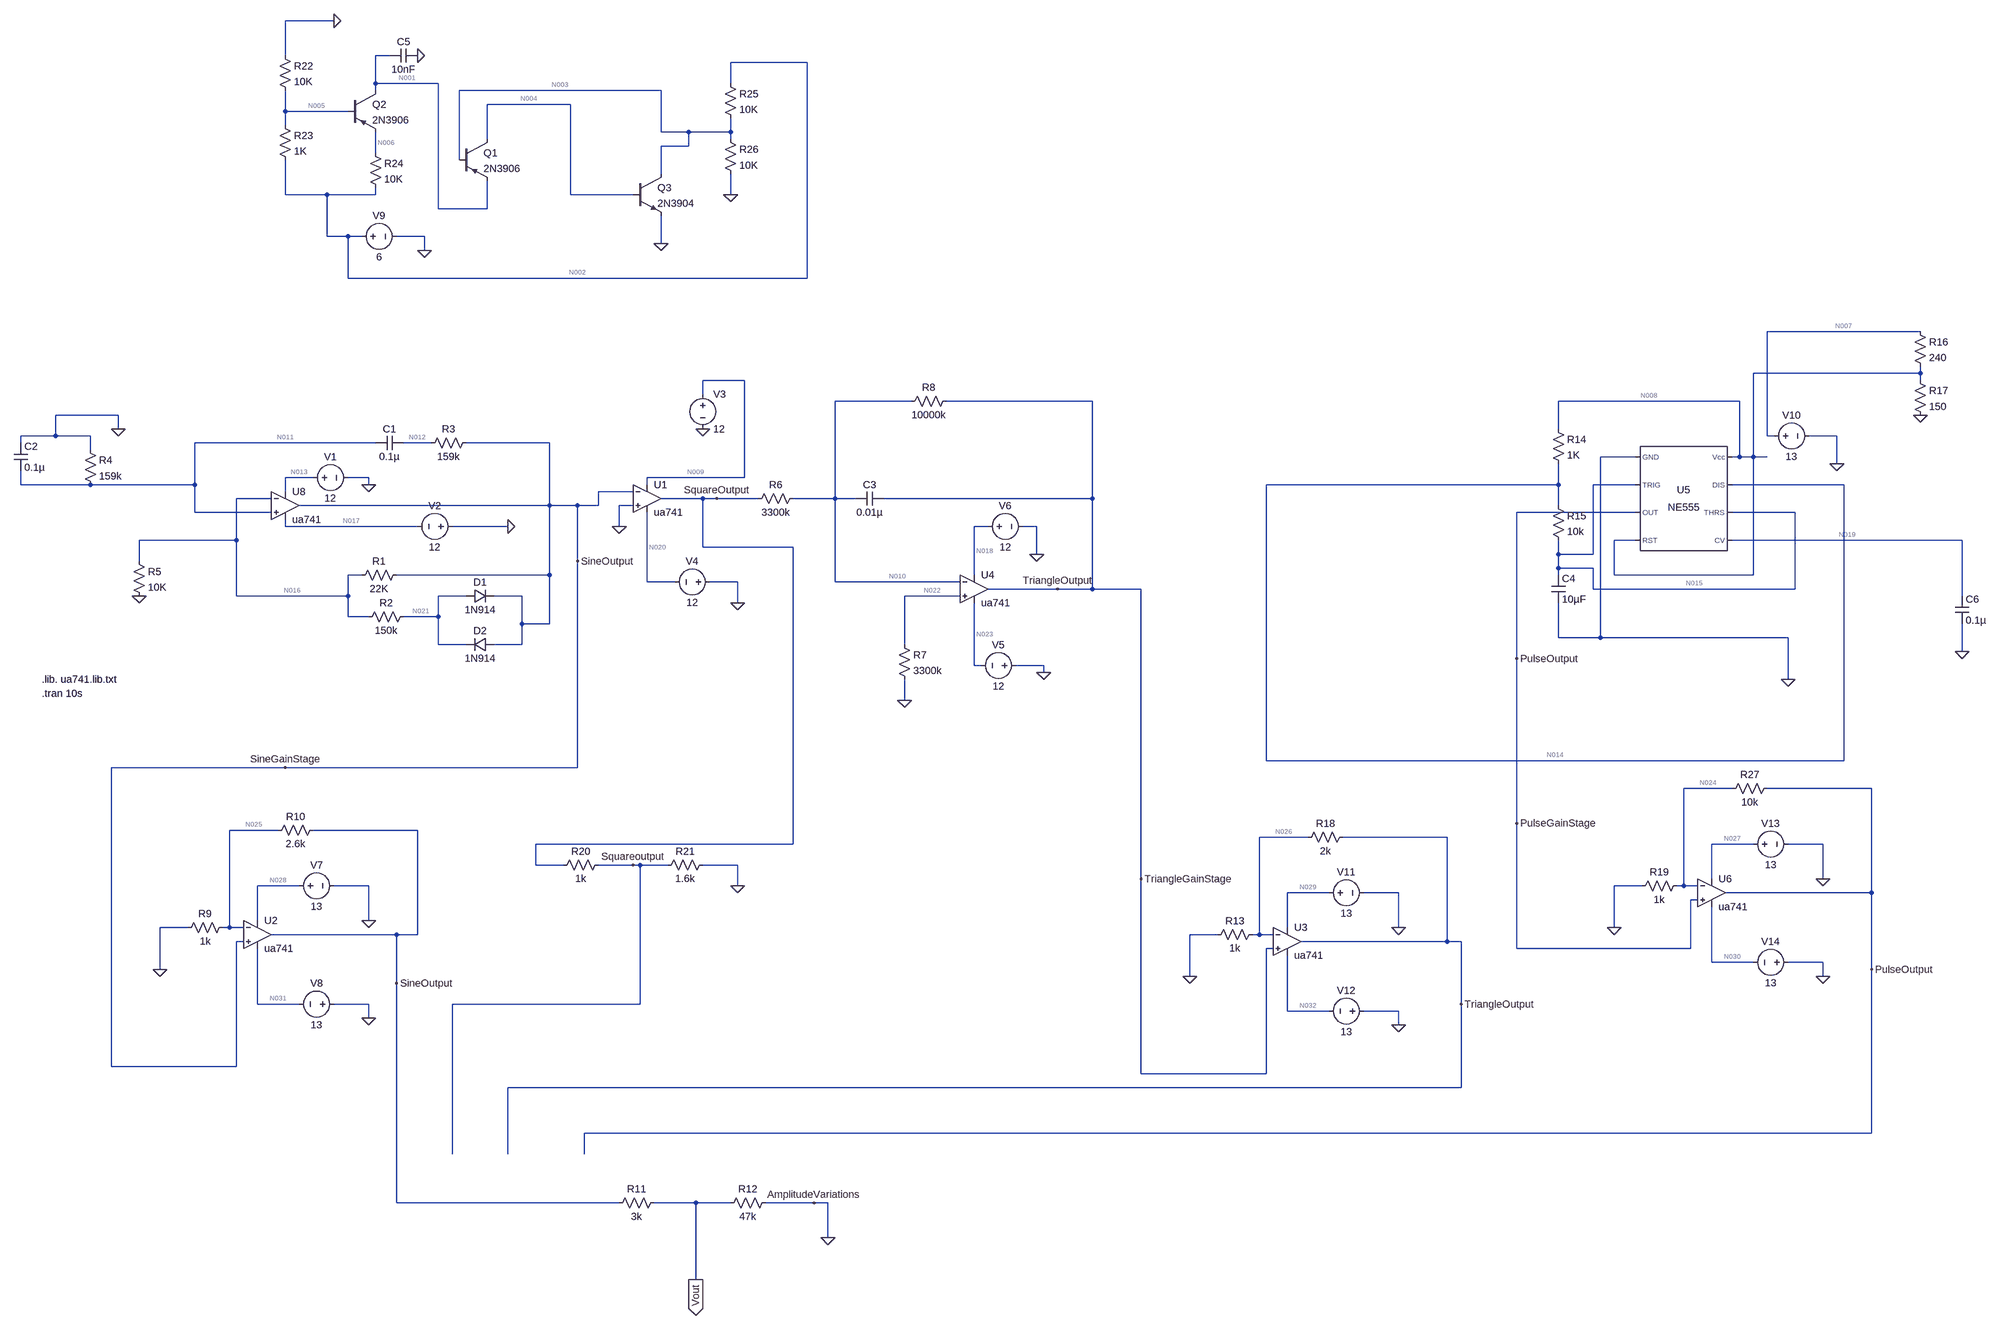
[diagram p0: schematic Final_circuit_simulation_openlab[1].asc]
Final_circuit_simulation_openlab[1].asc, the LTspice schematic file:
Version 4
SHEET 1 6320 2304
WIRE 352 -1136 240 -1136
WIRE 240 -1056 240 -1136
WIRE 480 -1056 448 -1056
WIRE 1440 -1040 1264 -1040
WIRE 448 -992 448 -1056
WIRE 592 -992 448 -992
WIRE 1264 -992 1264 -1040
WIRE 448 -976 448 -992
WIRE 1104 -976 640 -976
WIRE 896 -944 704 -944
WIRE 240 -928 240 -976
WIRE 384 -928 240 -928
WIRE 240 -896 240 -928
WIRE 1104 -880 1104 -976
WIRE 1168 -880 1104 -880
WIRE 1264 -880 1264 -912
WIRE 1264 -880 1168 -880
WIRE 704 -864 704 -944
WIRE 1264 -864 1264 -880
WIRE 1168 -848 1168 -880
WIRE 1168 -848 1104 -848
WIRE 448 -832 448 -880
WIRE 640 -816 640 -976
WIRE 1104 -784 1104 -848
WIRE 240 -736 240 -816
WIRE 336 -736 240 -736
WIRE 448 -736 448 -752
WIRE 448 -736 336 -736
WIRE 896 -736 896 -944
WIRE 1040 -736 896 -736
WIRE 1264 -736 1264 -784
WIRE 592 -704 592 -992
WIRE 704 -704 704 -768
WIRE 704 -704 592 -704
WIRE 336 -640 336 -736
WIRE 384 -640 336 -640
WIRE 416 -640 384 -640
WIRE 560 -640 496 -640
WIRE 1104 -624 1104 -688
WIRE 560 -608 560 -640
WIRE 384 -544 384 -640
WIRE 1440 -544 1440 -1040
WIRE 1440 -544 384 -544
WIRE 4000 -256 3648 -256
WIRE 4000 -160 4000 -176
WIRE 4000 -160 3616 -160
WIRE 1296 -144 1200 -144
WIRE 4000 -144 4000 -160
WIRE 1200 -112 1200 -144
WIRE 1680 -96 1504 -96
WIRE 2096 -96 1760 -96
WIRE 3584 -96 3168 -96
WIRE -144 -64 -288 -64
WIRE -144 -32 -144 -64
WIRE 3168 -32 3168 -96
WIRE -288 -16 -288 -64
WIRE -288 -16 -368 -16
WIRE -208 -16 -288 -16
WIRE 3648 -16 3648 -256
WIRE 3664 -16 3648 -16
WIRE 3808 -16 3744 -16
WIRE -368 0 -368 -16
WIRE 448 0 32 0
WIRE 576 0 512 0
WIRE 848 0 656 0
WIRE -208 16 -208 -16
WIRE 3344 32 3264 32
WIRE 3584 32 3584 -96
WIRE 3584 32 3568 32
WIRE 3616 32 3616 -160
WIRE 3616 32 3584 32
WIRE 3648 32 3616 32
WIRE 3808 48 3808 -16
WIRE 304 80 240 80
WIRE 432 80 384 80
WIRE 1296 80 1296 -144
WIRE 1296 80 1072 80
WIRE -368 96 -368 64
WIRE -208 96 -368 96
WIRE 32 96 32 0
WIRE 32 96 -208 96
WIRE 432 96 432 80
WIRE 1072 96 1072 80
WIRE 3168 96 3168 48
WIRE 3168 96 2496 96
WIRE 3344 96 3248 96
WIRE 3824 96 3568 96
WIRE 240 112 240 80
WIRE 1040 112 960 112
WIRE 208 128 128 128
WIRE 1200 128 1104 128
WIRE 1232 128 1200 128
WIRE 1328 128 1232 128
WIRE 1504 128 1504 -96
WIRE 1504 128 1408 128
WIRE 1552 128 1504 128
WIRE 2096 128 2096 -96
WIRE 2096 128 1616 128
WIRE 848 144 848 0
WIRE 848 144 272 144
WIRE 912 144 848 144
WIRE 960 144 960 112
WIRE 960 144 912 144
WIRE 1040 144 1008 144
WIRE 3168 144 3168 96
WIRE 32 160 32 96
WIRE 208 160 32 160
WIRE 3344 160 3072 160
WIRE 3712 160 3568 160
WIRE 240 192 240 176
WIRE 544 192 240 192
WIRE 752 192 624 192
WIRE 1008 192 1008 144
WIRE 1856 192 1824 192
WIRE 1968 192 1936 192
WIRE 128 224 128 128
WIRE 128 224 -96 224
WIRE 3344 224 3296 224
WIRE 4096 224 3568 224
WIRE 1200 240 1200 128
WIRE 1408 240 1200 240
WIRE 1968 256 1968 192
WIRE 3168 256 3168 224
WIRE 3248 256 3248 96
WIRE 3248 256 3168 256
WIRE -96 272 -96 224
WIRE 912 272 912 144
WIRE 3168 288 3168 256
WIRE 3248 288 3168 288
WIRE 416 304 384 304
WIRE 848 304 848 144
WIRE 848 304 496 304
WIRE 1824 304 1824 192
WIRE 3168 304 3168 288
WIRE 3296 304 3296 224
WIRE 3616 304 3616 32
WIRE 3616 304 3296 304
WIRE 1072 320 1072 160
WIRE 1136 320 1072 320
WIRE 1280 320 1216 320
WIRE 1504 320 1504 128
WIRE 1792 320 1504 320
WIRE 2016 336 1856 336
WIRE 2096 336 2096 128
WIRE 2096 336 2016 336
WIRE 2208 336 2096 336
WIRE 3248 336 3248 288
WIRE 3712 336 3712 160
WIRE 3712 336 3248 336
WIRE 128 352 128 224
WIRE 384 352 384 304
WIRE 384 352 128 352
WIRE 656 352 592 352
WIRE 784 352 720 352
WIRE 1792 352 1664 352
WIRE 4096 352 4096 224
WIRE 1280 368 1280 320
WIRE 384 400 384 352
WIRE 432 400 384 400
WIRE 592 400 592 352
WIRE 592 400 512 400
WIRE 784 416 784 352
WIRE 848 416 848 304
WIRE 848 416 784 416
WIRE 3168 448 3168 368
WIRE 3264 448 3264 32
WIRE 3264 448 3168 448
WIRE 3696 448 3264 448
WIRE 592 464 592 400
WIRE 656 464 592 464
WIRE 784 464 784 416
WIRE 784 464 720 464
WIRE 1664 464 1664 352
WIRE 4096 480 4096 416
WIRE 3072 496 3072 160
WIRE 1824 512 1824 368
WIRE 1840 512 1824 512
WIRE 1984 512 1920 512
WIRE 1984 528 1984 512
WIRE 3696 544 3696 448
WIRE 1664 592 1664 544
WIRE 2496 736 2496 96
WIRE 3824 736 3824 96
WIRE 3824 736 2496 736
WIRE 240 752 -160 752
WIRE 912 752 912 272
WIRE 912 752 240 752
WIRE 3568 800 3456 800
WIRE 3888 800 3648 800
WIRE 3072 880 3072 496
WIRE 224 896 112 896
WIRE 544 896 304 896
WIRE 2592 912 2480 912
WIRE 2912 912 2672 912
WIRE 1408 928 1408 240
WIRE 1408 928 816 928
WIRE 3616 928 3520 928
WIRE 3776 928 3696 928
WIRE 816 976 816 928
WIRE 880 976 816 976
WIRE 1040 976 960 976
WIRE 1056 976 1040 976
WIRE 1120 976 1056 976
WIRE 1280 976 1200 976
WIRE 2208 1008 2208 336
WIRE 3520 1008 3520 928
WIRE 3776 1008 3776 928
WIRE 272 1024 176 1024
WIRE 432 1024 352 1024
WIRE 1280 1024 1280 976
WIRE 3360 1024 3296 1024
WIRE 3456 1024 3456 800
WIRE 3456 1024 3440 1024
WIRE 3488 1024 3456 1024
WIRE 2640 1040 2544 1040
WIRE 2800 1040 2720 1040
WIRE 3888 1040 3888 800
WIRE 3888 1040 3552 1040
WIRE 3488 1056 3472 1056
WIRE 176 1104 176 1024
WIRE 432 1104 432 1024
WIRE 16 1120 -48 1120
WIRE 112 1120 112 896
WIRE 112 1120 96 1120
WIRE 144 1120 112 1120
WIRE 2544 1120 2544 1040
WIRE 2800 1120 2800 1040
WIRE 3296 1120 3296 1024
WIRE 496 1136 208 1136
WIRE 544 1136 544 896
WIRE 544 1136 496 1136
WIRE 2384 1136 2320 1136
WIRE 2480 1136 2480 912
WIRE 2480 1136 2464 1136
WIRE 2512 1136 2480 1136
WIRE 144 1152 128 1152
WIRE 2912 1152 2912 912
WIRE 2912 1152 2576 1152
WIRE 2944 1152 2912 1152
WIRE 2512 1168 2496 1168
WIRE 3072 1168 3072 880
WIRE 3472 1168 3472 1056
WIRE 3472 1168 3072 1168
WIRE 3520 1200 3520 1072
WIRE 3616 1200 3520 1200
WIRE 3776 1200 3696 1200
WIRE -48 1216 -48 1120
WIRE 3888 1216 3888 1040
WIRE 2320 1232 2320 1136
WIRE 3776 1232 3776 1200
WIRE 496 1248 496 1136
WIRE 176 1296 176 1168
WIRE 272 1296 176 1296
WIRE 432 1296 352 1296
WIRE 1056 1296 1056 976
WIRE 1056 1296 624 1296
WIRE 2944 1296 2944 1152
WIRE 2544 1312 2544 1184
WIRE 2640 1312 2544 1312
WIRE 2800 1312 2720 1312
WIRE 432 1328 432 1296
WIRE 2800 1344 2800 1312
WIRE -160 1440 -160 752
WIRE 128 1440 128 1152
WIRE 128 1440 -160 1440
WIRE 2208 1456 2208 1008
WIRE 2496 1456 2496 1168
WIRE 2496 1456 2208 1456
WIRE 2944 1488 2944 1296
WIRE 2944 1488 752 1488
WIRE 3888 1600 3888 1216
WIRE 3888 1600 928 1600
WIRE 624 1648 624 1296
WIRE 752 1648 752 1488
WIRE 928 1648 928 1600
WIRE 496 1760 496 1248
WIRE 1008 1760 496 1760
WIRE 1184 1760 1088 1760
WIRE 1264 1760 1184 1760
WIRE 1456 1760 1344 1760
WIRE 1488 1760 1456 1760
WIRE 1488 1840 1488 1760
WIRE 1184 1936 1184 1760
FLAG -144 -32 0
FLAG -96 352 0
FLAG 432 96 0
FLAG 752 192 0
FLAG 1200 -32 0
FLAG 1280 368 0
FLAG 1008 192 0
FLAG 1968 256 0
FLAG 1984 528 0
FLAG 1664 592 0
FLAG 1232 128 SquareOutput
FLAG 1280 1024 0
FLAG -48 1216 0
FLAG 432 1104 0
FLAG 432 1328 0
FLAG 1488 1840 0
FLAG 560 -608 0
FLAG 352 -1136 0
FLAG 544 -1056 0
FLAG 1264 -736 0
FLAG 1104 -624 0
FLAG 3808 48 0
FLAG 3696 544 0
FLAG 4000 -64 0
FLAG 1184 1936 Vout
IOPIN 1184 1936 Out
FLAG 4096 480 0
FLAG 2320 1232 0
FLAG 2800 1120 0
FLAG 2800 1344 0
FLAG 1040 976 Squareoutput
FLAG 912 272 SineOutput
FLAG 240 752 SineGainStage
FLAG 496 1248 SineOutput
FLAG 2944 1296 TriangleOutput
FLAG 2016 336 TriangleOutput
FLAG 2208 1008 TriangleGainStage
FLAG 1456 1760 AmplitudeVariations
FLAG 3296 1120 0
FLAG 3776 1008 0
FLAG 3776 1232 0
FLAG 3072 496 PulseOutput
FLAG 3072 880 PulseGainStage
FLAG 3888 1216 PulseOutput
SYMBOL res 512 288 R90
WINDOW 0 0 56 VBottom 2
WINDOW 3 32 56 VTop 2
SYMATTR InstName R1
SYMATTR Value 22K
SYMBOL res 528 384 R90
WINDOW 0 0 56 VBottom 2
WINDOW 3 32 56 VTop 2
SYMATTR InstName R2
SYMATTR Value 150k
SYMBOL diode 656 368 R270
WINDOW 0 32 32 VTop 2
WINDOW 3 0 32 VBottom 2
SYMATTR InstName D1
SYMATTR Value 1N914
SYMBOL diode 720 448 R90
WINDOW 0 0 32 VBottom 2
WINDOW 3 32 32 VTop 2
SYMATTR InstName D2
SYMATTR Value 1N914
SYMBOL res 672 -16 R90
WINDOW 0 0 56 VBottom 2
WINDOW 3 32 56 VTop 2
SYMATTR InstName R3
SYMATTR Value 159k
SYMBOL cap 512 -16 R90
WINDOW 0 0 32 VBottom 2
WINDOW 3 32 32 VTop 2
SYMATTR InstName C1
SYMATTR Value 0.1µ
SYMBOL cap -384 0 R0
SYMATTR InstName C2
SYMATTR Value 0.1µ
SYMBOL res -224 0 R0
SYMATTR InstName R4
SYMATTR Value 159k
SYMBOL res -112 256 R0
SYMATTR InstName R5
SYMATTR Value 10K
SYMBOL voltage 288 80 R270
WINDOW 0 32 56 VTop 2
WINDOW 3 -32 56 VBottom 2
WINDOW 123 0 0 Left 0
WINDOW 39 0 0 Left 0
SYMATTR InstName V1
SYMATTR Value 12
SYMBOL voltage 640 192 R90
WINDOW 0 -32 56 VBottom 2
WINDOW 3 32 56 VTop 2
WINDOW 123 0 0 Left 0
WINDOW 39 0 0 Left 0
SYMATTR InstName V2
SYMATTR Value 12
SYMBOL voltage 1200 -128 R0
WINDOW 123 0 0 Left 0
WINDOW 39 0 0 Left 0
SYMATTR InstName V3
SYMATTR Value 12
SYMBOL voltage 1232 320 R90
WINDOW 0 -32 56 VBottom 2
WINDOW 3 32 56 VTop 2
WINDOW 123 0 0 Left 0
WINDOW 39 0 0 Left 0
SYMATTR InstName V4
SYMATTR Value 12
SYMBOL res 1424 112 R90
WINDOW 0 0 56 VBottom 2
WINDOW 3 32 56 VTop 2
SYMATTR InstName R6
SYMATTR Value 3300k
SYMBOL voltage 1936 512 R90
WINDOW 0 -32 56 VBottom 2
WINDOW 3 32 56 VTop 2
SYMATTR InstName V5
SYMATTR Value 12
SYMBOL voltage 1840 192 R270
WINDOW 0 32 56 VTop 2
WINDOW 3 -32 56 VBottom 2
SYMATTR InstName V6
SYMATTR Value 12
SYMBOL cap 1616 112 R90
WINDOW 0 0 32 VBottom 2
WINDOW 3 32 32 VTop 2
SYMATTR InstName C3
SYMATTR Value 0.01µ
SYMBOL res 1648 448 R0
SYMATTR InstName R7
SYMATTR Value 3300k
SYMBOL res 1776 -112 R90
WINDOW 0 0 56 VBottom 2
WINDOW 3 32 56 VTop 2
SYMATTR InstName R8
SYMATTR Value 10000k
SYMBOL OpAmps\\ua741 1072 64 R0
SYMATTR InstName U1
SYMBOL OpAmps\\ua741 1824 272 R0
SYMATTR InstName U4
SYMBOL OpAmps\\ua741 240 80 R0
SYMATTR InstName U8
SYMBOL res 976 960 R90
WINDOW 0 0 56 VBottom 2
WINDOW 3 32 56 VTop 2
SYMATTR InstName R20
SYMATTR Value 1k
SYMBOL res 1216 960 R90
WINDOW 0 0 56 VBottom 2
WINDOW 3 32 56 VTop 2
SYMATTR InstName R21
SYMATTR Value 1.6k
SYMBOL OpAmps\\ua741 176 1072 R0
SYMATTR InstName U2
SYMBOL res 112 1104 R90
WINDOW 0 0 56 VBottom 2
WINDOW 3 32 56 VTop 2
SYMATTR InstName R9
SYMATTR Value 1k
SYMBOL voltage 256 1024 R270
WINDOW 0 32 56 VTop 2
WINDOW 3 -32 56 VBottom 2
SYMATTR InstName V7
SYMATTR Value 13
SYMBOL voltage 368 1296 R90
WINDOW 0 -32 56 VBottom 2
WINDOW 3 32 56 VTop 2
SYMATTR InstName V8
SYMATTR Value 13
SYMBOL res 320 880 R90
WINDOW 0 0 56 VBottom 2
WINDOW 3 32 56 VTop 2
SYMATTR InstName R10
SYMATTR Value 2.6k
SYMBOL res 1104 1744 R90
WINDOW 0 0 56 VBottom 2
WINDOW 3 32 56 VTop 2
SYMATTR InstName R11
SYMATTR Value 3k
SYMBOL res 1360 1744 R90
WINDOW 0 0 56 VBottom 2
WINDOW 3 32 56 VTop 2
SYMATTR InstName R12
SYMATTR Value 47k
SYMBOL pnp 640 -864 R0
SYMATTR InstName Q1
SYMATTR Value 2N3906
SYMBOL pnp 384 -976 R0
SYMATTR InstName Q2
SYMATTR Value 2N3906
SYMBOL npn 1040 -784 R0
SYMATTR InstName Q3
SYMATTR Value 2N3904
SYMBOL res 224 -1072 R0
SYMATTR InstName R22
SYMATTR Value 10K
SYMBOL res 224 -912 R0
SYMATTR InstName R23
SYMATTR Value 1K
SYMBOL res 432 -848 R0
SYMATTR InstName R24
SYMATTR Value 10K
SYMBOL voltage 400 -640 R270
WINDOW 0 32 56 VTop 2
WINDOW 3 -32 56 VBottom 2
WINDOW 123 0 0 Left 0
WINDOW 39 0 0 Left 0
SYMATTR InstName V9
SYMATTR Value 6
SYMBOL cap 544 -1072 R90
WINDOW 0 0 32 VBottom 2
WINDOW 3 32 32 VTop 2
SYMATTR InstName C5
SYMATTR Value 10nF
SYMBOL res 1248 -1008 R0
SYMATTR InstName R25
SYMATTR Value 10K
SYMBOL res 1248 -880 R0
SYMATTR InstName R26
SYMATTR Value 10K
SYMBOL Misc\\NE555 3456 128 R0
SYMATTR InstName U5
SYMBOL voltage 3648 -16 R270
WINDOW 0 32 56 VTop 2
WINDOW 3 -32 56 VBottom 2
WINDOW 123 0 0 Left 0
WINDOW 39 0 0 Left 0
SYMATTR InstName V10
SYMATTR Value 13
SYMBOL res 3152 -48 R0
SYMATTR InstName R14
SYMATTR Value 1K
SYMBOL res 3152 128 R0
SYMATTR InstName R15
SYMATTR Value 10k
SYMBOL cap 3152 304 R0
SYMATTR InstName C4
SYMATTR Value 10µF
SYMBOL res 3984 -272 R0
SYMATTR InstName R16
SYMATTR Value 240
SYMBOL res 3984 -160 R0
SYMATTR InstName R17
SYMATTR Value 150
SYMBOL cap 4080 352 R0
SYMATTR InstName C6
SYMATTR Value 0.1µ
SYMBOL OpAmps\\ua741 2544 1088 R0
SYMATTR InstName U3
SYMBOL res 2480 1120 R90
WINDOW 0 0 56 VBottom 2
WINDOW 3 32 56 VTop 2
SYMATTR InstName R13
SYMATTR Value 1k
SYMBOL voltage 2624 1040 R270
WINDOW 0 32 56 VTop 2
WINDOW 3 -32 56 VBottom 2
SYMATTR InstName V11
SYMATTR Value 13
SYMBOL voltage 2736 1312 R90
WINDOW 0 -32 56 VBottom 2
WINDOW 3 32 56 VTop 2
SYMATTR InstName V12
SYMATTR Value 13
SYMBOL res 2688 896 R90
WINDOW 0 0 56 VBottom 2
WINDOW 3 32 56 VTop 2
SYMATTR InstName R18
SYMATTR Value 2k
SYMBOL OpAmps\\ua741 3520 976 R0
SYMATTR InstName U6
SYMBOL res 3456 1008 R90
WINDOW 0 0 56 VBottom 2
WINDOW 3 32 56 VTop 2
SYMATTR InstName R19
SYMATTR Value 1k
SYMBOL voltage 3600 928 R270
WINDOW 0 32 56 VTop 2
WINDOW 3 -32 56 VBottom 2
SYMATTR InstName V13
SYMATTR Value 13
SYMBOL voltage 3712 1200 R90
WINDOW 0 -32 56 VBottom 2
WINDOW 3 32 56 VTop 2
SYMATTR InstName V14
SYMATTR Value 13
SYMBOL res 3664 784 R90
WINDOW 0 0 56 VBottom 2
WINDOW 3 32 56 VTop 2
SYMATTR InstName R27
SYMATTR Value 10k
TEXT -320 544 Left 2 !.lib. ua741.lib.txt
TEXT -320 576 Left 2 !.tran 10s

The netlist it stands for:
* Final_circuit_simulation_openlab[1].asc
R1 SineGainStage N016 22K
R2 N021 N016 150k
D1 N021 SineGainStage 1N914
D2 SineGainStage N021 1N914
R3 SineGainStage N012 159k
C1 N012 N011 0.1µ
C2 0 N011 0.1µ
R4 0 N011 159k
R5 N016 0 10K
V1 N013 0 12
V2 0 N017 12
V3 N009 0 12
V4 0 N020 12
R6 N010 SquareOutput 3300k
V5 0 N023 12
V6 N018 0 12
C3 TriangleGainStage N010 0.01µ
R7 N022 0 3300k
R8 TriangleGainStage N010 10000k
XU1 0 SineGainStage N009 N020 SquareOutput ua741  ; pins In+ In- V+ V- OUT
XU4 N022 N010 N018 N023 TriangleGainStage ua741  ; pins In+ In- V+ V- OUT
XU8 N011 N016 N013 N017 SineGainStage ua741  ; pins In+ In- V+ V- OUT
R20 SquareOutput SquareOutput 1k
R21 0 SquareOutput 1.6k
XU2 SineGainStage N025 N028 N031 SineGainStage ua741  ; pins In+ In- V+ V- OUT
R9 N025 0 1k
V7 N028 0 13
V8 0 N031 13
R10 SineGainStage N025 2.6k
R11 Vout SineGainStage 3k
R12 0 Vout 47k
Q1 N004 N003 N001 0 2N3906
Q2 N001 N005 N006 0 2N3906
Q3 N003 N004 0 0 2N3904
R22 0 N005 10K
R23 N005 N002 1K
R24 N006 N002 10K
V9 N002 0 6
C5 0 N001 10nF
R25 N002 N003 10K
R26 N003 0 10K
XU5 0 N015 PulseGainStage N008 N019 N015 N014 N008 NE555  ; pins GND TRIG OUT RST CV THRS DIS Vcc
V10 N007 0 13
R14 N008 N014 1K
R15 N014 N015 10k
C4 N015 0 10µF
R16 N007 N008 240
R17 N008 0 150
C6 N019 0 0.1µ
XU3 TriangleGainStage N026 N029 N032 TriangleGainStage ua741  ; pins In+ In- V+ V- OUT
R13 N026 0 1k
V11 N029 0 13
V12 0 N032 13
R18 TriangleGainStage N026 2k
XU6 PulseGainStage N024 N027 N030 PulseGainStage ua741  ; pins In+ In- V+ V- OUT
R19 N024 0 1k
V13 N027 0 13
V14 0 N030 13
R27 PulseGainStage N024 10k
.model D D
.lib standard.dio
.model NPN NPN
.model PNP PNP
.lib standard.bjt
.lib. ua741.lib.txt
.tran 10s
.lib NE555.sub
.backanno
.end

* Results of the author's LTspice run, read from the files saved beside the schematic
* Operating Point, zero values left out:
*   V(sinegainstage) = -101.6 mV
*   V(n016) = -32.25 mV
*   V(n021) = -33.85 mV
*   V(n012) = -101.6 mV
*   V(n011) = -15.35 mV
*   V(n013) = 12 V
*   V(n017) = -12 V
*   V(n009) = 12 V
*   V(n020) = -12 V
*   V(n010) = 5.441 V
*   V(squareoutput) = 11.61 V
*   V(n023) = -12 V
*   V(n018) = 12 V
*   V(trianglegainstage) = -11.62 V
*   V(n022) = 55.44 µV
*   V(n031) = -13 V
*   V(n028) = 13 V
*   V(n025) = -28.32 mV
*   V(vout) = -95.48 mV
*   V(n004) = 641.2 mV
*   V(n003) = 133.5 mV
*   V(n001) = 660.2 mV
*   V(n005) = 5.455 V
*   V(n006) = 5.963 V
*   V(n002) = 6 V
*   V(n015) = nan V
*   V(n019) = nan V
*   V(n008) = nan V
*   V(n014) = nan V
*   V(pulsegainstage) = nan V
*   V(n007) = 13 V
*   V(n032) = -13 V
*   V(n029) = 13 V
*   V(n026) = -3.872 V
*   V(n030) = -13 V
*   V(n027) = 13 V
*   V(n024) = nan V
*   Ic(Q3) = 574.2 µA
*   Ib(Q3) = 2.779 µA
*   Ie(Q3) = -577 µA
*   Ic(Q2) = -3.652 µA
*   Ib(Q2) = -17.42 nA
*   Ie(Q2) = 3.67 µA
*   Ic(Q1) = -2.779 µA
*   Ib(Q1) = -873 nA
*   Ie(Q1) = 3.652 µA
*   I(C6) = nan A
*   I(C4) = nan A
*   I(D2) = -1.955 nA
*   I(D1) = 8.712 nA
*   I(R27) = nan A
*   I(R19) = nan A
*   I(R18) = -3.872 mA
*   I(R13) = -3.872 mA
*   I(R17) = nan A
*   I(R16) = nan A
*   I(R15) = nan A
*   I(R14) = nan A
*   I(R26) = 13.35 µA
*   I(R25) = 586.7 µA
*   I(R24) = -3.67 µA
*   I(R23) = -545.4 µA
*   I(R22) = -545.5 µA
*   I(R12) = 2.031 µA
*   I(R11) = 2.031 µA
*   I(R10) = -28.18 µA
*   I(R9) = -28.32 µA
*   I(R21) = -7.257 mA
*   I(R8) = -1.706 µA
*   I(R7) = 16.8 pA
*   I(R6) = -1.87 µA
*   I(R5) = -3.225 µA
*   I(R4) = 96.53 nA
*   I(R2) = -10.67 nA
*   I(R1) = -3.151 µA
*   I(V14) = nan A
*   I(V13) = nan A
*   I(V12) = -1.447 mA
*   I(V11) = -1.446 mA
*   I(V10) = nan A
*   I(V9) = -1.136 mA
*   I(V8) = -1.447 mA
*   I(V7) = -1.447 mA
*   I(V6) = -1.337 mA
*   I(V5) = -1.32 mA
*   I(V4) = -1.337 mA
*   I(V3) = -1.322 mA
*   I(V2) = -1.337 mA
*   I(V1) = -1.337 mA